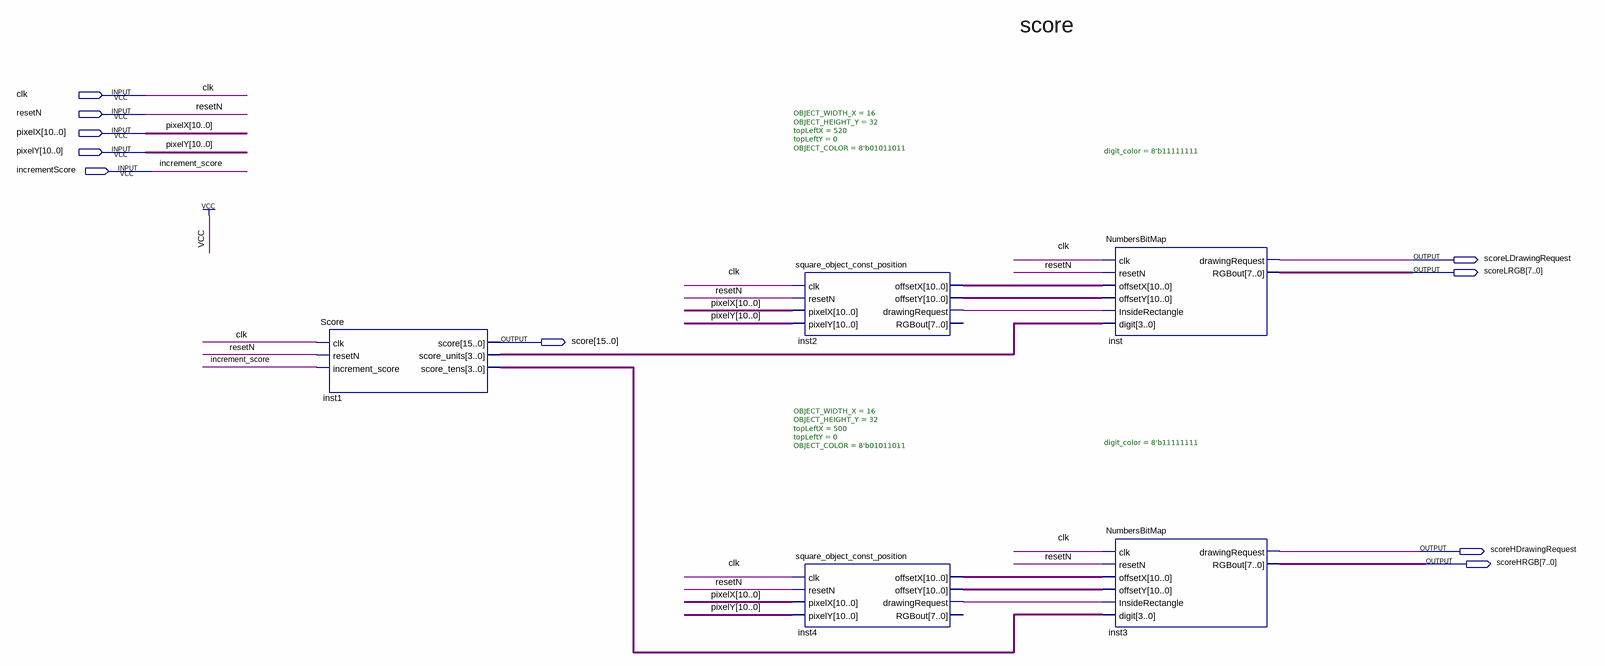
[diagram p0: schematic sheet]
// Quartus schematic SCORE_DISPLAY.bdf as structural Verilog: 5 symbols, 10 pins
module SCORE_DISPLAY (
  input  clk,
  input  resetN,
  input  [10:0] pixelX,
  input  [10:0] pixelY,
  input  incrementScore,
  output scoreLDrawingRequest,
  output [7:0] scoreLRGB,
  output [15:0] score,
  output scoreHDrawingRequest,
  output [7:0] scoreHRGB
);

  wire inst2_drawingrequest, inst4_drawingrequest;
  wire [3:0] inst1_score_tens, inst1_score_units;
  wire [10:0] inst2_offsetx, inst2_offsety, inst4_offsetx, inst4_offsety;

  Score inst1 (
    .clk(clk), .resetN(resetN), .increment_score(incrementScore), .score(score),
    .score_units(inst1_score_units), .score_tens(inst1_score_tens));
  square_object_const_position #(.OBJECT_WIDTH_X(16), .OBJECT_HEIGHT_Y(32), .topLeftX(520), .topLeftY(0), .OBJECT_COLOR(8'b01011011)) inst2 (
    .clk(clk), .resetN(resetN), .pixelX(pixelX), .pixelY(pixelY), .offsetX(inst2_offsetx),
    .offsetY(inst2_offsety), .drawingRequest(inst2_drawingrequest));  // open: RGBout
  square_object_const_position #(.OBJECT_WIDTH_X(16), .OBJECT_HEIGHT_Y(32), .topLeftX(500), .topLeftY(0), .OBJECT_COLOR(8'b01011011)) inst4 (
    .clk(clk), .resetN(resetN), .pixelX(pixelX), .pixelY(pixelY), .offsetX(inst4_offsetx),
    .offsetY(inst4_offsety), .drawingRequest(inst4_drawingrequest));  // open: RGBout
  NumbersBitMap #(.digit_color(8'b11111111)) inst (
    .clk(clk), .resetN(resetN), .offsetX(inst2_offsetx), .offsetY(inst2_offsety),
    .InsideRectangle(inst2_drawingrequest), .digit(inst1_score_units), .drawingRequest(scoreLDrawingRequest),
    .RGBout(scoreLRGB));
  NumbersBitMap #(.digit_color(8'b11111111)) inst3 (
    .clk(clk), .resetN(resetN), .offsetX(inst4_offsetx), .offsetY(inst4_offsety),
    .InsideRectangle(inst4_drawingrequest), .digit(inst1_score_tens), .drawingRequest(scoreHDrawingRequest),
    .RGBout(scoreHRGB));

  // Other names for the same wires on the sheet: increment_score = incrementScore

  // Notes on the sheet:
  //   score
endmodule
